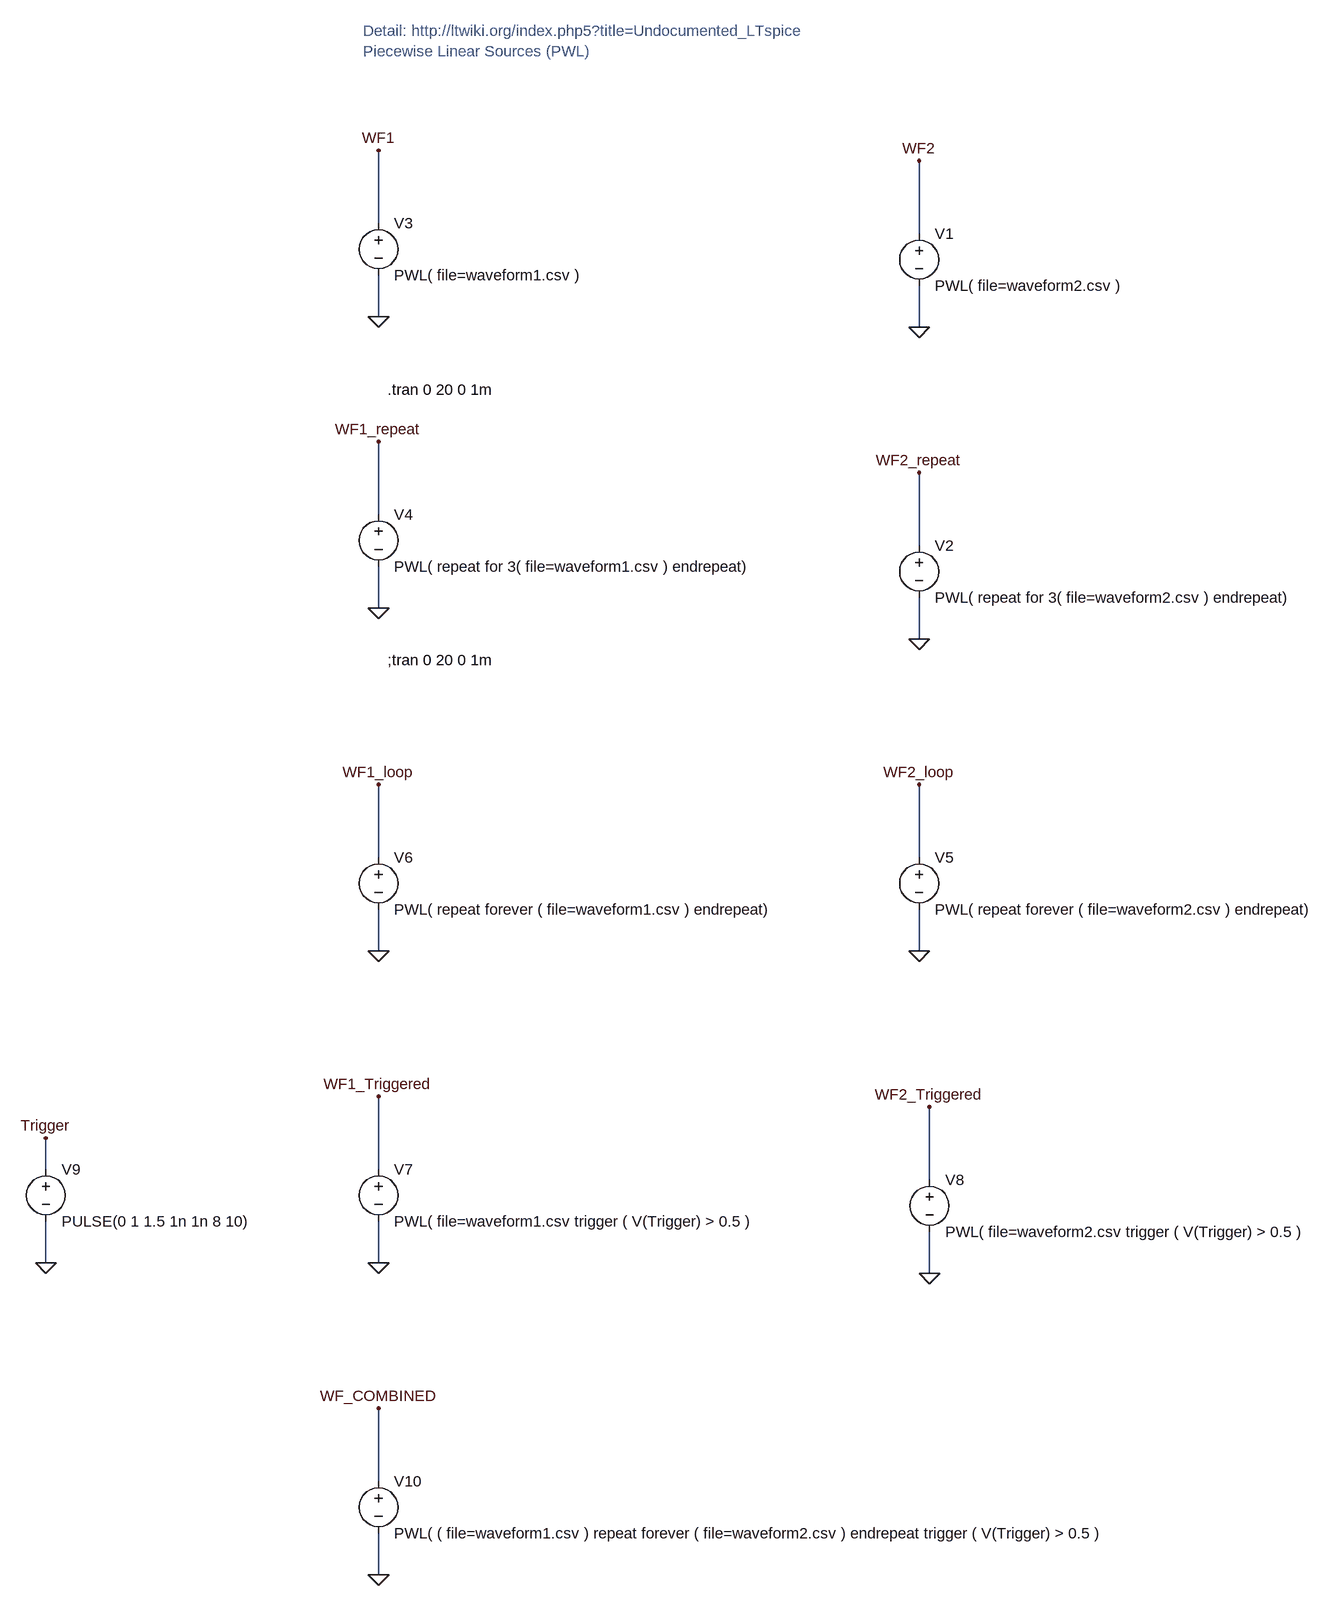
[diagram p0: schematic pwl.test.asc]
pwl.test.asc, the LTspice schematic file:
Version 4
SHEET 1 1176 2228
WIRE -384 128 -384 16
WIRE 448 144 448 32
WIRE -384 272 -384 208
WIRE 448 288 448 224
WIRE -384 576 -384 464
WIRE 448 624 448 512
WIRE -384 720 -384 656
WIRE 448 768 448 704
WIRE -384 1104 -384 992
WIRE 448 1104 448 992
WIRE -384 1248 -384 1184
WIRE 448 1248 448 1184
WIRE -896 1584 -896 1536
WIRE -384 1584 -384 1472
WIRE 464 1600 464 1488
WIRE -896 1728 -896 1664
WIRE -384 1728 -384 1664
WIRE 464 1744 464 1680
WIRE -384 2064 -384 1952
WIRE -384 2208 -384 2144
FLAG 448 288 0
FLAG -384 272 0
FLAG -384 16 WF1
FLAG 448 32 WF2
FLAG 448 768 0
FLAG -384 720 0
FLAG -384 464 WF1_repeat
FLAG 448 512 WF2_repeat
FLAG 448 1248 0
FLAG -384 1248 0
FLAG -384 992 WF1_loop
FLAG 448 992 WF2_loop
FLAG -384 1728 0
FLAG -384 1472 WF1_Triggered
FLAG 464 1744 0
FLAG 464 1488 WF2_Triggered
FLAG -896 1728 0
FLAG -896 1536 Trigger
FLAG -384 2208 0
FLAG -384 1952 WF_COMBINED
SYMBOL voltage 448 128 R0
WINDOW 123 0 0 Left 2
WINDOW 39 0 0 Left 2
SYMATTR InstName V1
SYMATTR Value PWL( file=waveform2.csv )
SYMBOL voltage -384 112 R0
WINDOW 123 0 0 Left 2
WINDOW 39 0 0 Left 2
SYMATTR InstName V3
SYMATTR Value PWL( file=waveform1.csv )
SYMBOL voltage 448 608 R0
WINDOW 123 0 0 Left 2
WINDOW 39 0 0 Left 2
SYMATTR InstName V2
SYMATTR Value PWL( repeat for 3( file=waveform2.csv ) endrepeat)
SYMBOL voltage -384 560 R0
SYMATTR InstName V4
SYMATTR Value PWL( repeat for 3( file=waveform1.csv ) endrepeat)
SYMBOL voltage 448 1088 R0
WINDOW 123 0 0 Left 2
WINDOW 39 0 0 Left 2
SYMATTR InstName V5
SYMATTR Value PWL( repeat forever ( file=waveform2.csv ) endrepeat)
SYMBOL voltage -384 1088 R0
SYMATTR InstName V6
SYMATTR Value PWL( repeat forever ( file=waveform1.csv ) endrepeat)
SYMBOL voltage -384 1568 R0
SYMATTR InstName V7
SYMATTR Value PWL( file=waveform1.csv trigger ( V(Trigger) > 0.5 )
SYMBOL voltage 464 1584 R0
SYMATTR InstName V8
SYMATTR Value PWL( file=waveform2.csv trigger ( V(Trigger) > 0.5 )
SYMBOL voltage -896 1568 R0
WINDOW 123 0 0 Left 2
WINDOW 39 0 0 Left 2
SYMATTR InstName V9
SYMATTR Value PULSE(0 1 1.5 1n 1n 8 10)
SYMBOL voltage -384 2048 R0
SYMATTR InstName V10
SYMATTR Value PWL( ( file=waveform1.csv ) repeat forever ( file=waveform2.csv ) endrepeat trigger ( V(Trigger) > 0.5 )
TEXT -370 384 Left 2 !.tran 0 20 0 1m
TEXT -408 -168 Left 2 ;Detail: http://ltwiki.org/index.php5?title=Undocumented_LTspice\nPiecewise Linear Sources (PWL)
TEXT -370 800 Left 2 !;tran 0 20 0 1m

The netlist it stands for:
* pwl.test.asc
V1 WF2 0 PWL( file=waveform2.csv )
V3 WF1 0 PWL( file=waveform1.csv )
V2 WF2_repeat 0 PWL( repeat for 3( file=waveform2.csv ) endrepeat)
V4 WF1_repeat 0 PWL( repeat for 3( file=waveform1.csv ) endrepeat)
V5 WF2_loop 0 PWL( repeat forever ( file=waveform2.csv ) endrepeat)
V6 WF1_loop 0 PWL( repeat forever ( file=waveform1.csv ) endrepeat)
V7 WF1_Triggered 0 PWL( file=waveform1.csv trigger ( V(Trigger) > 0.5 )
V8 WF2_Triggered 0 PWL( file=waveform2.csv trigger ( V(Trigger) > 0.5 )
V9 Trigger 0 PULSE(0 1 1.5 1n 1n 8 10)
V10 WF_COMBINED 0 PWL( ( file=waveform1.csv ) repeat forever ( file=waveform2.csv ) endrepeat trigger ( V(Trigger) > 0.5 )
.tran 0 20 0 1m
* Detail: http://ltwiki.org/index.php5?title=Undocumented_LTspice
* Piecewise Linear Sources (PWL)
;tran 0 20 0 1m
.backanno
.end